# EAGLE design PWM_LuefterReglerGT15V (EAGLE 9.6.2)
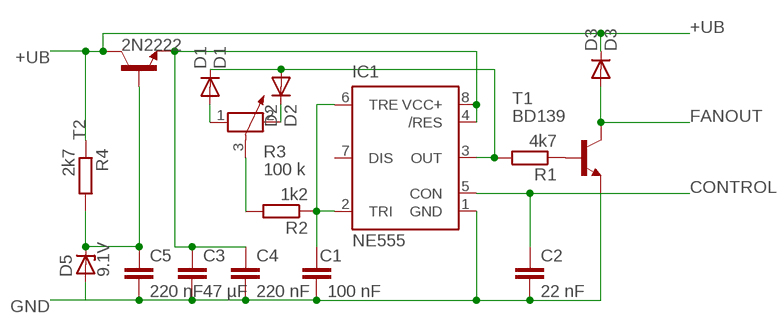
[diagram p0: schematic, sheet 1]

## Parts
C1  100 nF  C2,5-3  [C2.5-3]
C2  22 nF  C7.5/3  [C7.5B3]
C3  47 µF  C5/4.5  [C5B4.5]
C4  220 nF  C7.5/3  [C7.5B3]
C5  220 nF  C7.5/3  [C7.5B3]
D1  D1  1N4148DO35-10  [DO35-10]
D2  D2  1N4148DO35-10  [DO35-10]
D3  D3  1N4148DO35-10  [DO35-10]
D5  9.1V  ZENER-DIODEZD-7.5  [ZDIO-7.5]
IC1  NE555  [DIL-08]
R1  4k7  R-EU_0207/10  [0207/10]
R2  1k2  R-EU_0207/10  [0207/10]
R3  100 k  POTENTIOMETER_PT-10  [PT-10]
R4  2k7  R-EU_0207/10  [0207/10]
T1  BD139  [TO126]
T2  2N2222  [TO18]

## Nets
+UB: D3.C R4.1 T2.3(C)
CONTROL: C2.2 IC1.5(CON)
FANOUT: D3.A T1.2(C)
GND: C1.1 C2.1 C3.2 C4.2 C5.2 D5.A IC1.1(GND) T1.1(E)
N$1: C1.2 IC1.2(TRI) IC1.6(TRE) R2.1
N$2: D2.C R3.2
N$3: R2.2 R3.3
N$4: D1.A R3.1
N$5: D1.C D2.A IC1.3(OUT) R1.2
N$7: R1.1 T1.3(B)
N$10: C5.1 D5.C R4.2 T2.2(B)
N$12: C3.1 C4.1 IC1.4(/RES) IC1.8(VCC+) T2.1(E)
Unconnected: IC1.7(DIS)

## Library data of the parts
C1-C5 = capacitor-wima:C: CAPACITOR naming: grid - package width
D1-D3 = diode:1N4148: DIODE high speed (Philips)
D5 = diode:ZENER-DIODE: Z-Diode
IC1 = st-microelectronics:NE555: General purpose bipolar Timer; MF: Arrow Electronics; MPN: NE555N; OC_FARNELL: 1467742; OC_NEWARK: 89K1486
R1 R2 R4 = rcl:R-EU_: RESISTOR, European symbol
R3 = rcl:POTENTIOMETER_: Potentiometer
T1 = transistor:BD139: NPN TRANSISTOR
T2 = transistor:2N2222: NPN TRANSISTOR

## Board
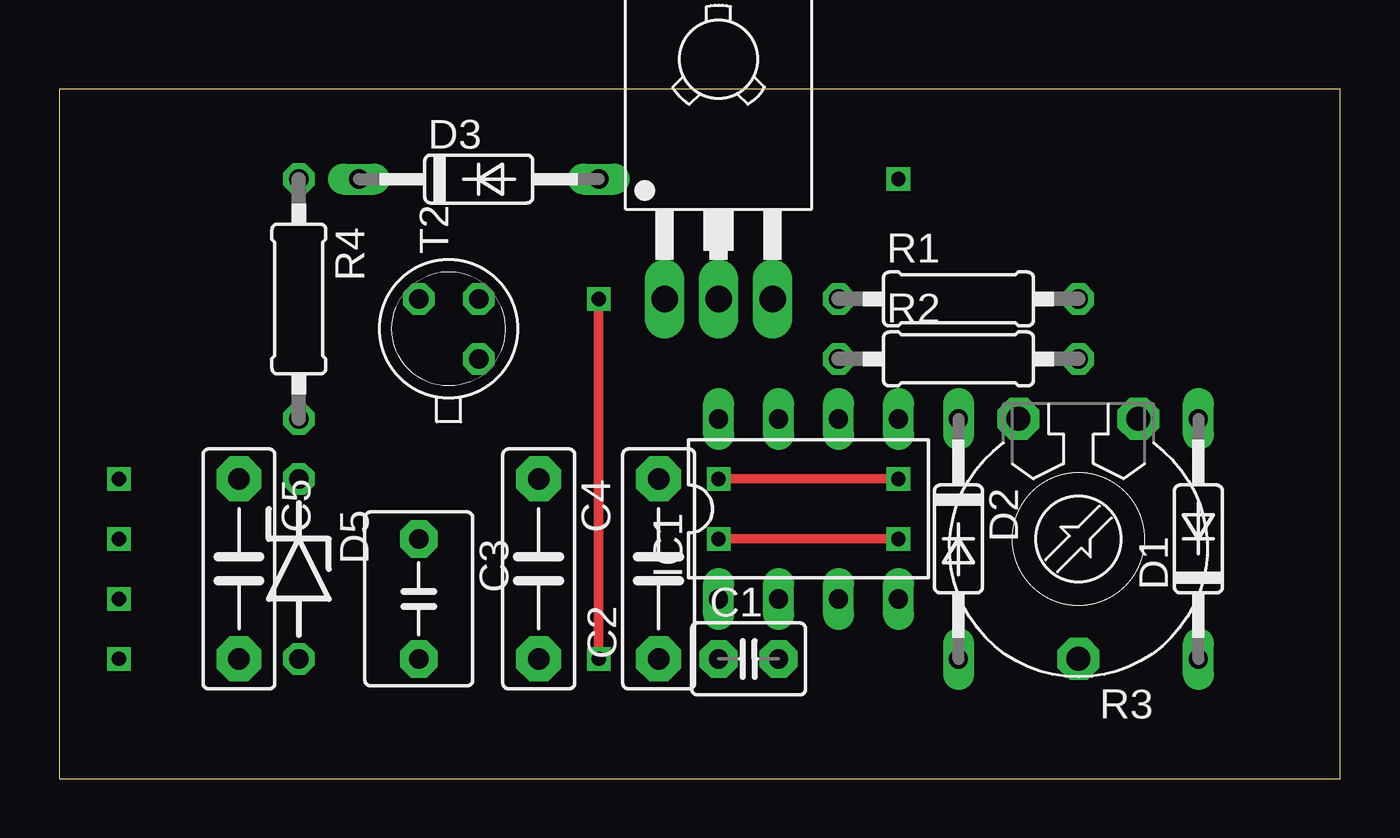
[diagram p1: board, top side]
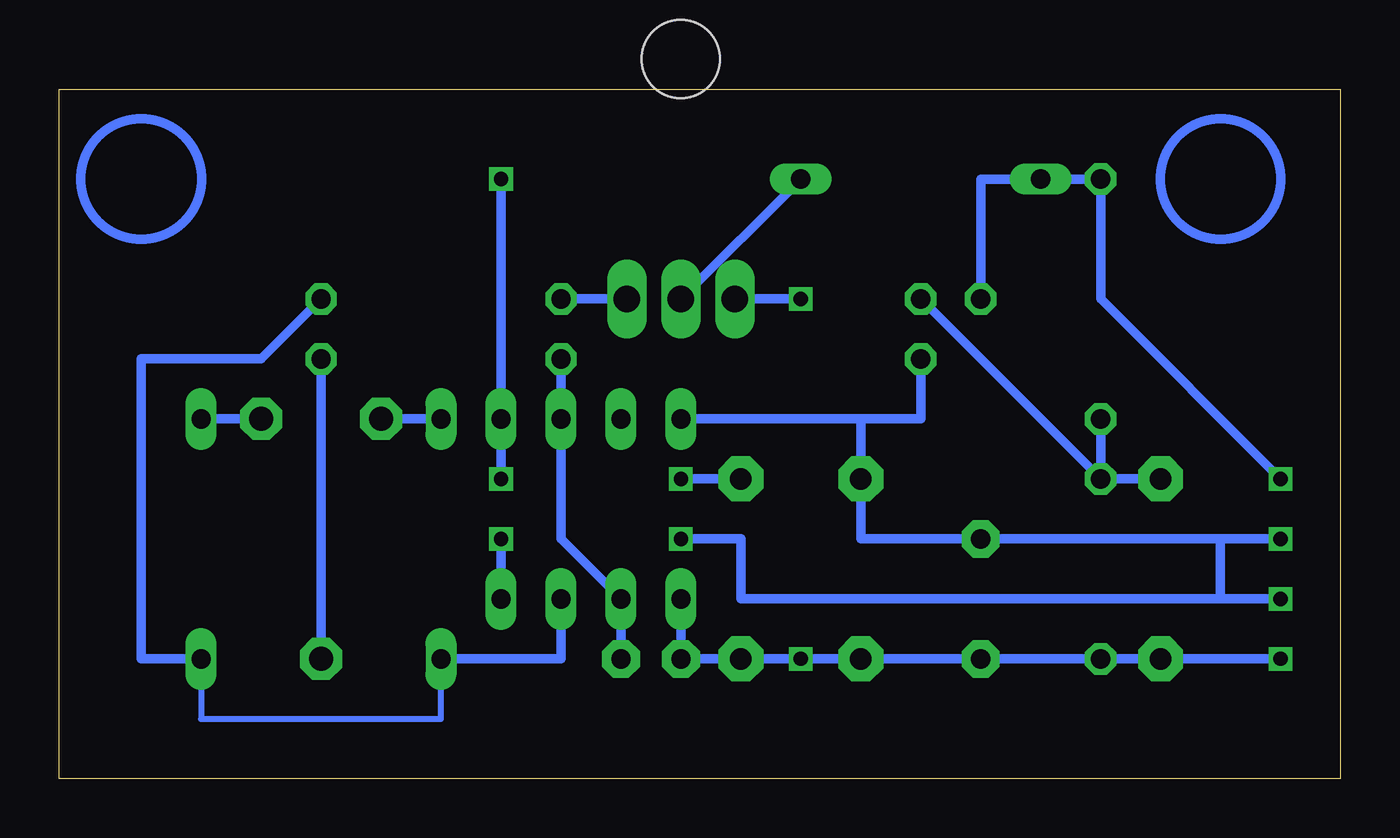
[diagram p2: board, bottom side, seen from below]

Size 54.28 x 29.2 mm. Coordinates in mm from the lower left corner, seen from the top.
Outline: 0,0 54.28,0 54.28,29.2 0,29.2 0,0
Copper layers (1*16): Top 0.035mm / dielectric 1.5mm / Bottom 0.035mm
Design rules: minimum track width 10mil, minimum drill 24mil, track to track 8mil, track to pad 8mil, pad to pad 8mil, via to via 8mil, smd to smd 8mil, copper to edge 40mil, drill to drill 8mil, minimum pad ring 10mil, minimum via ring 8mil, stop-mask expansion 4mil, vias tented up to drill 0mil, thermal gap 10mil

### Footprints (pad centres in the part's own frame; a part is rotated, then mirrored left to right if it is on the bottom)
C2.5-3 = drill 0.813 pad 1.6 octagon: 1 -1.27,0; 2 1.27,0
C7.5B3 = drill 0.914 pad 1.905 octagon: 1 -3.81,0; 2 3.81,0
C5B4.5 = drill 0.813 pad 1.6 octagon: 1 -2.54,0; 2 2.54,0
DO35-10 = drill 0.813 long: A 5.08,0; C -5.08,0
ZDIO-7.5 = drill 0.813 octagon: A 3.81,0; C -3.81,0
DIL-08 = drill 0.813 long: 1 -3.81,-3.81; 2 -1.27,-3.81; 3 1.27,-3.81; 4 3.81,-3.81; 5 3.81,3.81; 6 1.27,3.81; 7 -1.27,3.81; 8 -3.81,3.81
0207/10 = drill 0.813 octagon: 1 -5.08,0; 2 5.08,0
PT-10 = drill 1.016 pad 1.778 octagon: 1 -2.54,-5.08; 2 2.54,-5.08; 3 0,5.08
TO126 = drill 1.118 long: 1 -2.286,-5.08; 2 0,-5.08; 3 2.286,-5.08 | hole 3.302: 0,5.08
TO18 = drill 0.813 octagon: 1 -1.27,-1.27; 2 1.27,-1.27; 3 1.27,1.27

### Placement (x,y rotation side)
C1  29.21,5.08 0 top
C2  25.4,8.89 90 top
C3  15.24,7.62 270 top
C4  20.32,8.89 270 top
C5  7.62,8.89 270 top
D1  48.26,10.16 90 top
D2  38.1,10.16 270 top
D3  17.78,25.4 0 top
D5  10.16,8.89 270 top
IC1  31.75,11.43 0 top
R1  38.1,20.32 0 top
R2  38.1,17.78 0 top
R3  43.18,10.16 180 top
R4  10.16,20.32 270 top
T1  27.94,25.4 0 top
T2  16.51,19.05 90 top

### Tracks (layer width: path | path; a pad name or v marks a point on that pad's centre or on a via)
+UB  (via drill 0.6)
  Bottom 0.406: T2.3 15.24,25.4 D3.C R4.1 10.16,20.32 v2.54,12.7
CONTROL  (via drill 0.6)
  Top 0.406: v27.94,12.7 v35.56,12.7
  Bottom 0.406: C2.2 v27.94,12.7 | v35.56,12.7 IC1.5 v35.56,25.4
FANOUT
  Bottom 0.406: D3.A T1.2
GND  (via drill 0.6)
  Top 0.406: v22.86,5.08 v22.86,20.32
  Bottom 0.406: C1.1 C2.1 C4.2 C3.2 D5.A C5.2 v2.54,5.08 | IC1.1 C1.1 | C1.1 v22.86,5.08 | v22.86,20.32 25.4,20.32 25.4,20.07 T1.1
N$1
  Bottom 0.406: R2.1 IC1.6 33.02,10.16 IC1.2 C1.2
N$2
  Bottom 0.406: D2.C R3.2
N$3
  Bottom 0.406: R2.2 R3.3
N$4
  Bottom 0.406: R3.1 D1.A
N$5
  Bottom 0.254: D2.A 38.1,2.54 48.26,2.54 D1.C
  Bottom 0.406: IC1.3 33.02,5.08 D2.A | D1.C 50.8,5.08 50.8,17.78 45.72,17.78 R1.2
N$7
  Bottom 0.406: R1.1 T1.3
N$10
  Bottom 0.406: C5.1 D5.C | T2.2 D5.C | R4.2 D5.C
N$12  (via drill 0.6)
  Top 0.406: v35.56,10.16 v27.94,10.16
  Bottom 0.406: 20.32,15.24 C4.1 20.32,10.16 C3.1 5.08,10.16 | 20.32,15.24 IC1.8 | IC1.4 v35.56,10.16 | v27.94,10.16 25.4,10.16 25.4,7.62 5.08,7.62 | 5.08,7.62 5.08,10.16 | T2.1 17.78,15.24 20.32,15.24 | 5.08,10.16 v2.54,10.16 | 5.08,7.62 v2.54,7.62
(copper drawn outside any net)
  shapes: Bottom circle x2